# Altium project sch_v1.PrjPcb
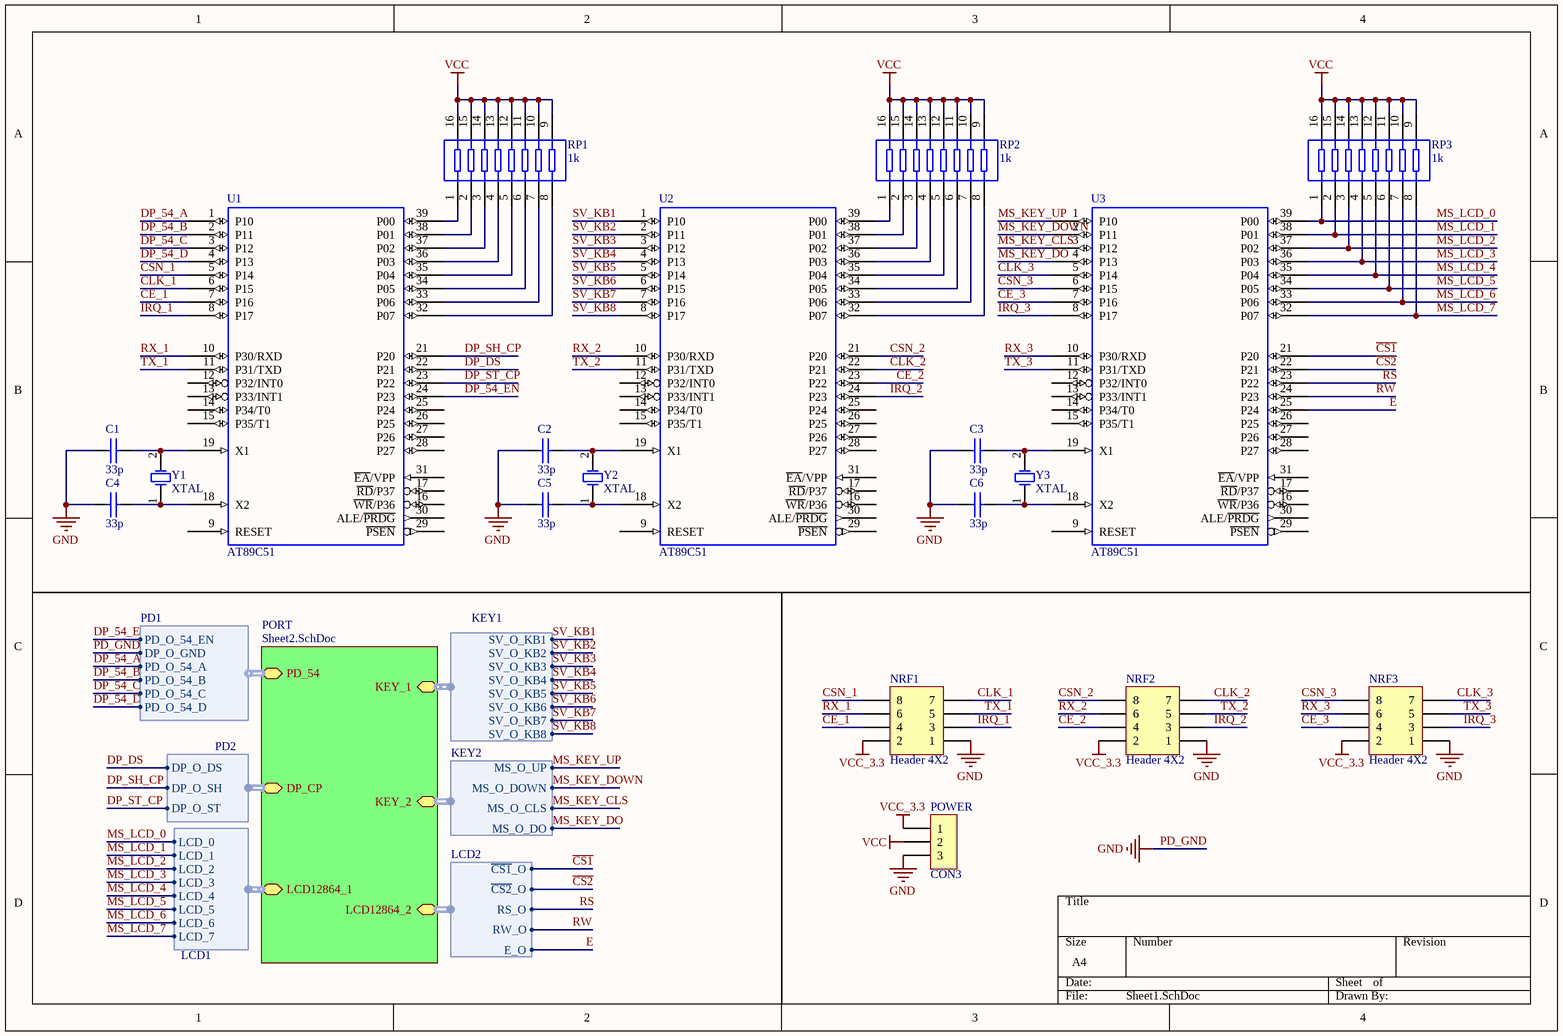
[diagram p0: Sheet1.SchDoc]
2 sheets, 66 parts. Net scope: hierarchical (ports join the sheet entries above them; power ports are global).
Sheets:
  Sheet1.SchDoc
    PORT = Sheet2.SchDoc

## Sheet Sheet1.SchDoc
size A4

### Parts
C1  33p  [RAD0.1]
C2  33p  [RAD0.1]
C3  33p  [RAD0.1]
C4  33p  [RAD0.1]
C5  33p  [RAD0.1]
C6  33p  [RAD0.1]
NRF1  Header 4X2  [HDR2X4]
NRF2  Header 4X2  [HDR2X4]
NRF3  Header 4X2  [HDR2X4]
POWER  CON3
RP1  1k  [DIP16]
RP2  1k  [DIP16]
RP3  1k  [DIP16]
U1  AT89C51  [DIP-40]
U2  AT89C51  [DIP-40]
U3  AT89C51  [DIP-40]
Y1  XTAL  [XTAL]
Y2  XTAL  [XTAL]
Y3  XTAL  [XTAL]

### Sub-sheets
PORT = Sheet2.SchDoc: PD_54 (harness PD1), KEY_1 (harness KEY1), KEY_2 (harness KEY2), DP_CP (harness PD2), LCD12864_1 (harness LCD1), LCD12864_2 (harness LCD2)

### Harnesses
PD1: DP_O_GND, PD_O_54_EN, PD_O_54_A, PD_O_54_B, PD_O_54_C, PD_O_54_D
KEY1: SV_O_KB1, SV_O_KB2, SV_O_KB3, SV_O_KB4, SV_O_KB5, SV_O_KB6, SV_O_KB7, SV_O_KB8
KEY2: MS_O_UP, MS_O_DOWN, MS_O_CLS, MS_O_DO
PD2: DP_O_SH, DP_O_ST, DP_O_DS
LCD1: LCD_0, LCD_1, LCD_2, LCD_3, LCD_4, LCD_5, LCD_6, LCD_7
LCD2: ~{CS1}_O, ~{CS2}_O, RS_O, RW_O, E_O

### Nets
GND: C1.1 C2.1 C3.1 C4.1 C5.1 C6.1 NRF1.1 NRF2.1 NRF3.1 POWER.3 U1.20(GND) U2.20(GND) U3.20(GND) ; sheet PORT/PD_54.DP_O_GND  [also labelled PD_GND]  [project net DP_GND]
VCC: POWER.2 RP1.9 RP1.10 RP1.11 RP1.12 RP1.13 RP1.14 RP1.15 RP1.16 RP2.9 RP2.10 RP2.11 RP2.12 RP2.13 RP2.14 RP2.15 RP2.16 RP3.9 RP3.10 RP3.11 RP3.12 RP3.13 RP3.14 RP3.15 RP3.16 U1.40(VCC) U2.40(VCC) U3.40(VCC)
VCC_3.3: NRF1.2 NRF2.2 NRF3.2 POWER.1
~{CS1}: U3.21(P20) ; sheet PORT/LCD12864_2.~{CS1}_O
~{CS2}: U3.22(P21) ; sheet PORT/LCD12864_2.~{CS2}_O
CE_1: NRF1.4 U1.7(P16)
CE_2: NRF2.4 U2.23(P22)
CE_3: NRF3.4 U3.7(P16)
CLK_1: NRF1.7 U1.6(P15)
CLK_2: NRF2.7 U2.22(P21)
CLK_3: NRF3.7 U3.5(P14)
CSN_1: NRF1.8 U1.5(P14)
CSN_2: NRF2.8 U2.21(P20)
CSN_3: NRF3.8 U3.6(P15)
DP_54_A: U1.1(P10) ; sheet PORT/PD_54.PD_O_54_A
DP_54_B: U1.2(P11) ; sheet PORT/PD_54.PD_O_54_B
DP_54_C: U1.3(P12) ; sheet PORT/PD_54.PD_O_54_C
DP_54_D: U1.4(P13) ; sheet PORT/PD_54.PD_O_54_D
DP_54_EN: U1.24(P23) ; sheet PORT/PD_54.PD_O_54_EN
DP_DS: U1.22(P21) ; sheet PORT/DP_CP.DP_O_DS
DP_SH_CP: U1.21(P20) ; sheet PORT/DP_CP.DP_O_SH
DP_ST_CP: U1.23(P22) ; sheet PORT/DP_CP.DP_O_ST
E: U3.25(P24) ; sheet PORT/LCD12864_2.E_O
IRQ_1: NRF1.3 U1.8(P17)
IRQ_2: NRF2.3 U2.24(P23)
IRQ_3: NRF3.3 U3.8(P17)
MS_KEY_CLS: U3.3(P12) ; sheet PORT/KEY_2.MS_O_CLS
MS_KEY_DO: U3.4(P13) ; sheet PORT/KEY_2.MS_O_DO
MS_KEY_DOWN: U3.2(P11) ; sheet PORT/KEY_2.MS_O_DOWN
MS_KEY_UP: U3.1(P10) ; sheet PORT/KEY_2.MS_O_UP
MS_LCD_0: RP3.1 U3.39(P00) ; sheet PORT/LCD12864_1.LCD_0
MS_LCD_1: RP3.2 U3.38(P01) ; sheet PORT/LCD12864_1.LCD_1
MS_LCD_2: RP3.3 U3.37(P02) ; sheet PORT/LCD12864_1.LCD_2
MS_LCD_3: RP3.4 U3.36(P03) ; sheet PORT/LCD12864_1.LCD_3
MS_LCD_4: RP3.5 U3.35(P04) ; sheet PORT/LCD12864_1.LCD_4
MS_LCD_5: RP3.6 U3.34(P05) ; sheet PORT/LCD12864_1.LCD_5
MS_LCD_6: RP3.7 U3.33(P06) ; sheet PORT/LCD12864_1.LCD_6
MS_LCD_7: RP3.8 U3.32(P07) ; sheet PORT/LCD12864_1.LCD_7
RS: U3.23(P22) ; sheet PORT/LCD12864_2.RS_O
RW: U3.24(P23) ; sheet PORT/LCD12864_2.RW_O
RX_1: NRF1.6 U1.10(P30/RXD)
RX_2: NRF2.6 U2.10(P30/RXD)
RX_3: NRF3.6 U3.10(P30/RXD)
SV_KB1: U2.1(P10) ; sheet PORT/KEY_1.SV_O_KB1
SV_KB2: U2.2(P11) ; sheet PORT/KEY_1.SV_O_KB2
SV_KB3: U2.3(P12) ; sheet PORT/KEY_1.SV_O_KB3
SV_KB4: U2.4(P13) ; sheet PORT/KEY_1.SV_O_KB4
SV_KB5: U2.5(P14) ; sheet PORT/KEY_1.SV_O_KB5
SV_KB6: U2.6(P15) ; sheet PORT/KEY_1.SV_O_KB6
SV_KB7: U2.7(P16) ; sheet PORT/KEY_1.SV_O_KB7
SV_KB8: U2.8(P17) ; sheet PORT/KEY_1.SV_O_KB8
TX_1: NRF1.5 U1.11(P31/TXD)
TX_2: NRF2.5 U2.11(P31/TXD)
TX_3: NRF3.5 U3.11(P31/TXD)
NetC1_2: C1.2 U1.19(X1) Y1.2
NetC2_2: C2.2 U2.19(X1) Y2.2
NetC3_2: C3.2 U3.19(X1) Y3.2
NetC4_2: C4.2 U1.18(X2) Y1.1
NetC5_2: C5.2 U2.18(X2) Y2.1
NetC6_2: C6.2 U3.18(X2) Y3.1
NetRP1_1: RP1.1 U1.39(P00)
NetRP1_2: RP1.2 U1.38(P01)
NetRP1_3: RP1.3 U1.37(P02)
NetRP1_4: RP1.4 U1.36(P03)
NetRP1_5: RP1.5 U1.35(P04)
NetRP1_6: RP1.6 U1.34(P05)
NetRP1_7: RP1.7 U1.33(P06)
NetRP1_8: RP1.8 U1.32(P07)
NetRP2_1: RP2.1 U2.39(P00)
NetRP2_2: RP2.2 U2.38(P01)
NetRP2_3: RP2.3 U2.37(P02)
NetRP2_4: RP2.4 U2.36(P03)
NetRP2_5: RP2.5 U2.35(P04)
NetRP2_6: RP2.6 U2.34(P05)
NetRP2_7: RP2.7 U2.33(P06)
NetRP2_8: RP2.8 U2.32(P07)

Not connected (* = marked no-connect by the designer): U1 9(RESET) 12(P32/INT0) 13(P33/INT1) 14(P34/T0) 15(P35/T1) 16(~{WR}/P36) 17(~{RD}/P37) 25(P24) 26(P25) 27(P26) 28(P27) 29(~{PSEN}) 30(ALE/~{PRDG}) 31(~{EA}/VPP); U2 9(RESET) 12(P32/INT0) 13(P33/INT1) 14(P34/T0) 15(P35/T1) 16(~{WR}/P36) 17(~{RD}/P37) 25(P24) 26(P25) 27(P26) 28(P27) 29(~{PSEN}) 30(ALE/~{PRDG}) 31(~{EA}/VPP); U3 9(RESET) 12(P32/INT0) 13(P33/INT1) 14(P34/T0) 15(P35/T1) 16(~{WR}/P36) 17(~{RD}/P37) 26(P25) 27(P26) 28(P27) 29(~{PSEN}) 30(ALE/~{PRDG}) 31(~{EA}/VPP)

### Library data of the parts
C1-C6 = 普通电容: Capacitor
NRF1-NRF3 = Header 4X2: Header, 4-Pin, Dual row; LatestRevisionDate: 17-Jul-2002; LatestRevisionNote: Re-released for DXP Platform.; Publisher: Altium Limited
POWER = CON3: Connector
RP1-RP3 = RESPACK4
Y1-Y3 = XTAL: XTAL: 12MHZ

## Sheet Sheet2.SchDoc
size A3
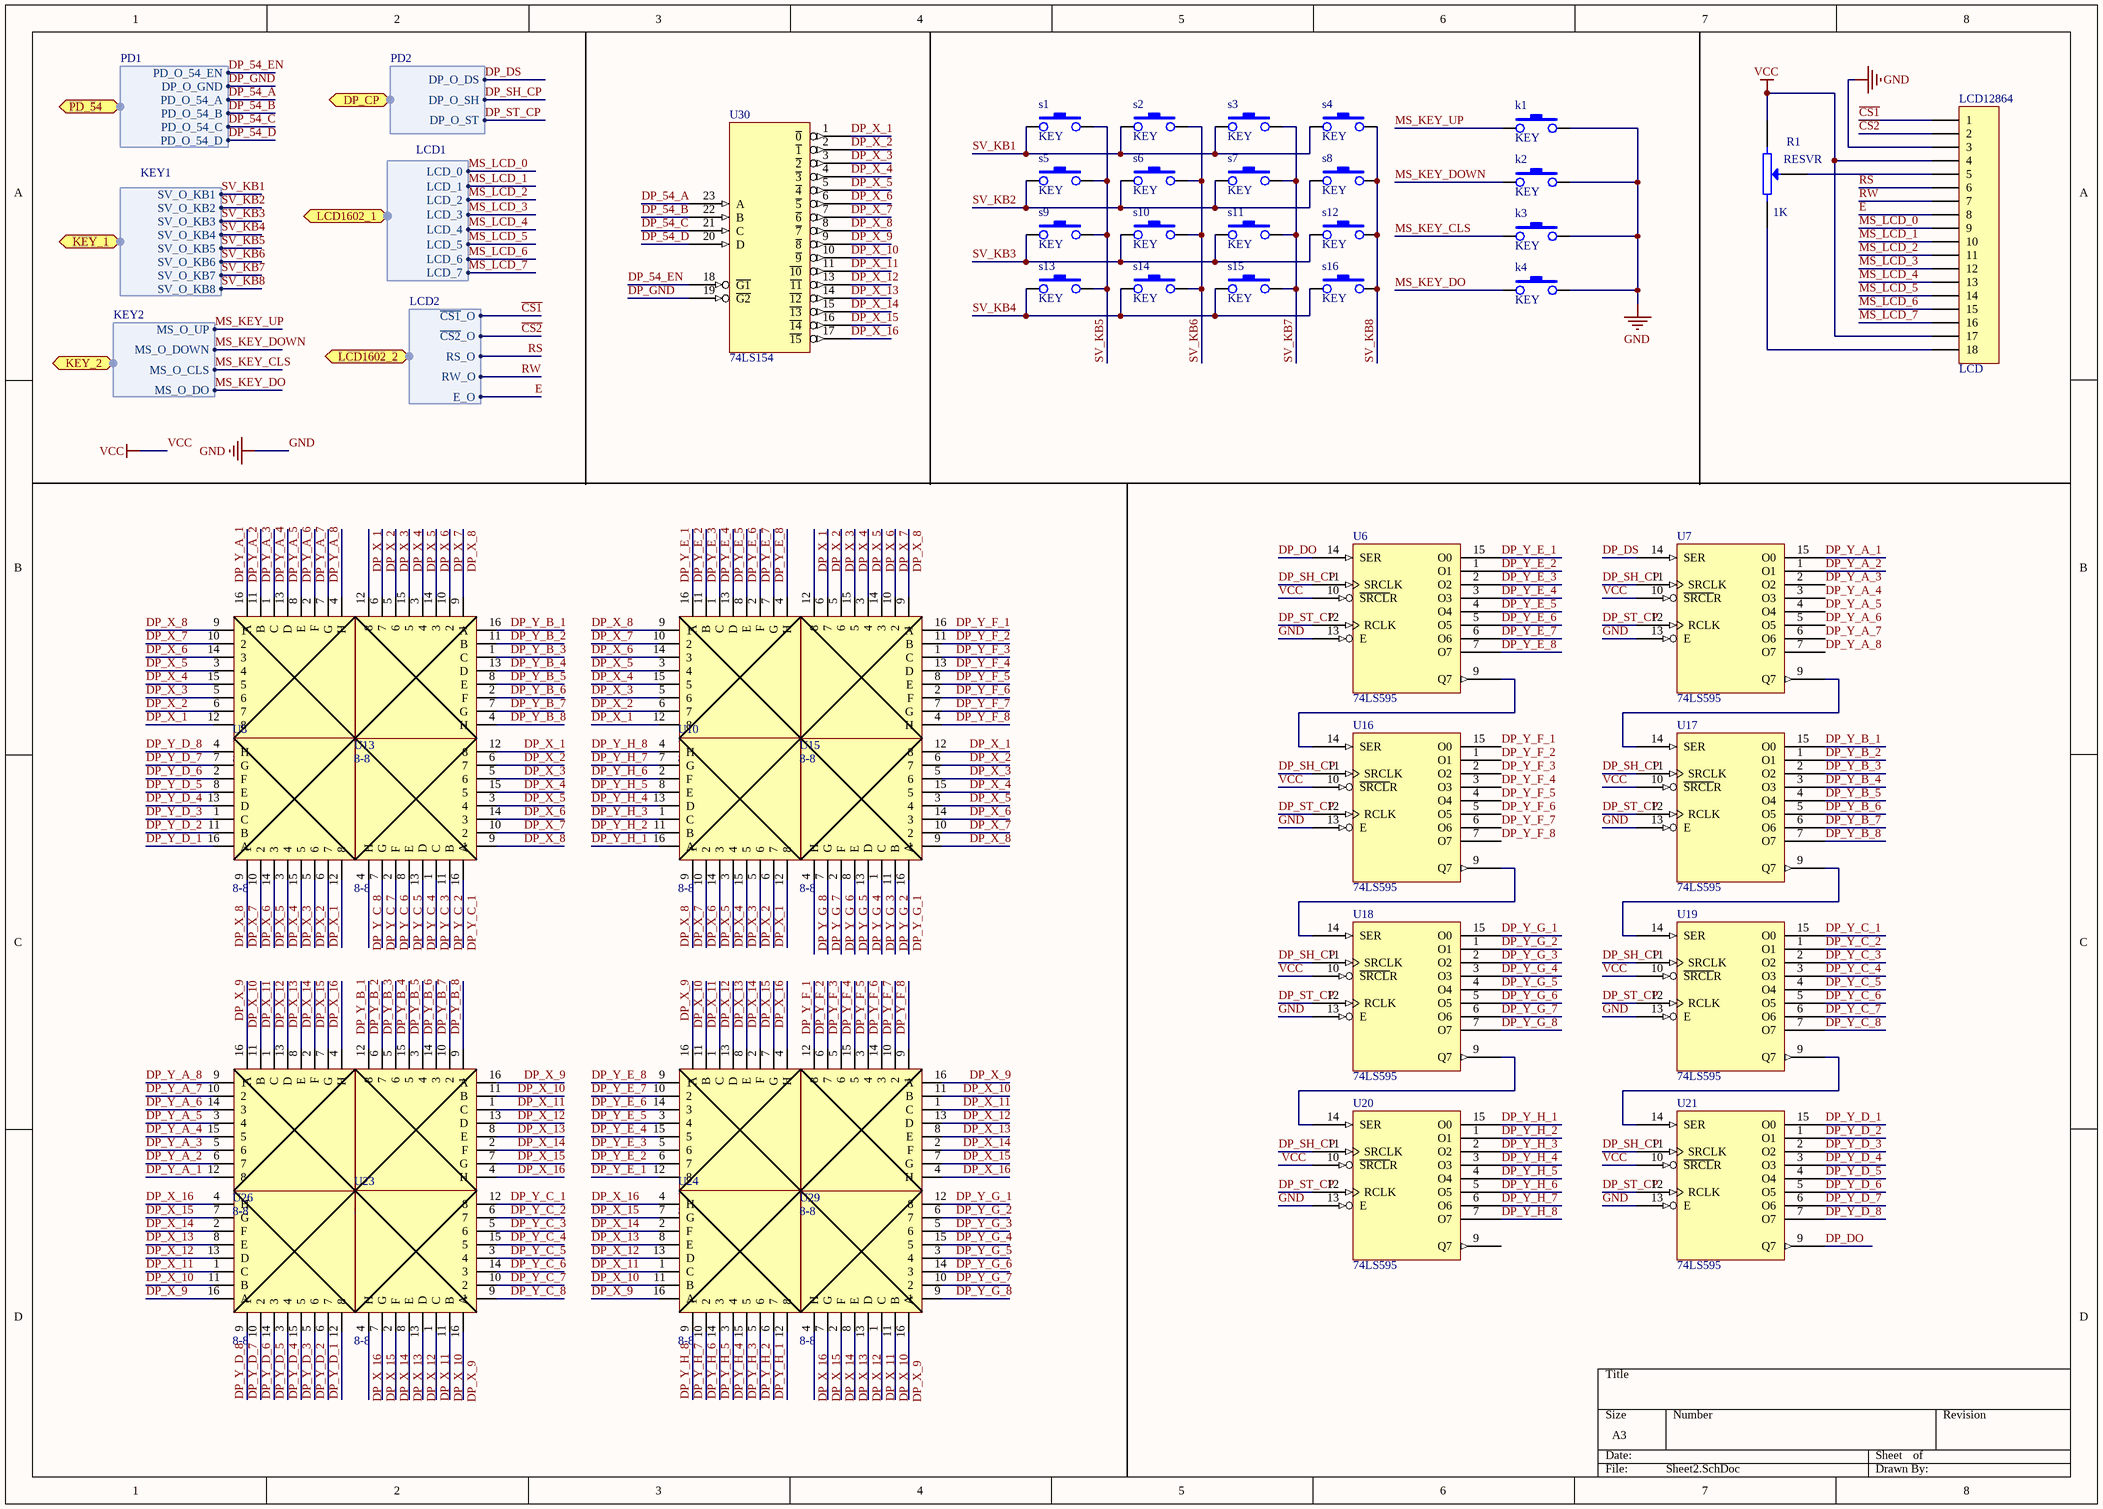
[diagram p1: Sheet2.SchDoc]

### Parts
k1  KEY
k2  KEY
k3  KEY
k4  KEY
LCD12864  LCD
R1  RESVR  value 1K  [VR]
s1  KEY
s2  KEY
s3  KEY
s4  KEY
s5  KEY
s6  KEY
s7  KEY
s8  KEY
s9  KEY
s10  KEY
s11  KEY
s12  KEY
s13  KEY
s14  KEY
s15  KEY
s16  KEY
U6  74LS595  [DIP-16]
U7  74LS595  [DIP-16]
U8  8-8
U9  8-8
U10  8-8
U11  8-8
U12  8-8
U13  8-8
U14  8-8
U15  8-8
U16  74LS595  [DIP-16]
U17  74LS595  [DIP-16]
U18  74LS595  [DIP-16]
U19  74LS595  [DIP-16]
U20  74LS595  [DIP-16]
U21  74LS595  [DIP-16]
U22  8-8
U23  8-8
U24  8-8
U25  8-8
U26  8-8
U27  8-8
U28  8-8
U29  8-8
U30  74LS154  [DIP-24]

### Ports
DP_CP (harness PD2), KEY_1 (harness KEY1), KEY_2 (harness KEY2), LCD1602_1 (harness LCD1), LCD1602_2 (harness LCD2), PD_54 (harness PD1)

### Harnesses
PD1: PD_O_54_EN, DP_O_GND, PD_O_54_A, PD_O_54_B, PD_O_54_C, PD_O_54_D
KEY1: SV_O_KB1, SV_O_KB2, SV_O_KB3, SV_O_KB4, SV_O_KB5, SV_O_KB6, SV_O_KB7, SV_O_KB8
KEY2: MS_O_UP, MS_O_DOWN, MS_O_CLS, MS_O_DO
PD2: DP_O_DS, DP_O_SH, DP_O_ST
LCD1: LCD_0, LCD_1, LCD_2, LCD_3, LCD_4, LCD_5, LCD_6, LCD_7
LCD2: ~{CS1}_O, ~{CS2}_O, RS_O, RW_O, E_O

### Nets
DP_GND: k1.2 k2.2 k3.2 k4.2 LCD12864.3 U6.8(GND) U6.13(E) U7.8(GND) U7.13(E) U16.8(GND) U16.13(E) U17.8(GND) U17.13(E) U18.8(GND) U18.13(E) U19.8(GND) U19.13(E) U20.8(GND) U20.13(E) U21.8(GND) U21.13(E) U30.12(GND) U30.19(~{G2}) ; port PD_54.DP_O_GND  [also labelled GND]
VCC: LCD12864.4 LCD12864.17 R1.1 U6.10(~{SRCL}R) U6.16(VCC) U7.10(~{SRCL}R) U7.16(VCC) U16.10(~{SRCL}R) U16.16(VCC) U17.10(~{SRCL}R) U17.16(VCC) U18.10(~{SRCL}R) U18.16(VCC) U19.10(~{SRCL}R) U19.16(VCC) U20.10(~{SRCL}R) U20.16(VCC) U21.10(~{SRCL}R) U21.16(VCC) U30.24(VCC)
~{CS1}: LCD12864.1 ; port LCD1602_2.~{CS1}_O
~{CS2}: LCD12864.2 ; port LCD1602_2.~{CS2}_O
DP_54_A: U30.23(A) ; port PD_54.PD_O_54_A
DP_54_B: U30.22(B) ; port PD_54.PD_O_54_B
DP_54_C: U30.21(C) ; port PD_54.PD_O_54_C
DP_54_D: U30.20(D) ; port PD_54.PD_O_54_D
DP_54_EN: U30.18(~{G1}) ; port PD_54.PD_O_54_EN
DP_DO: U6.14(SER) U21.9(Q7)
DP_DS: U7.14(SER) ; port DP_CP.DP_O_DS
DP_SH_CP: U6.11(SRCLK) U7.11(SRCLK) U16.11(SRCLK) U17.11(SRCLK) U18.11(SRCLK) U19.11(SRCLK) U20.11(SRCLK) U21.11(SRCLK) ; port DP_CP.DP_O_SH
DP_ST_CP: U6.12(RCLK) U7.12(RCLK) U16.12(RCLK) U17.12(RCLK) U18.12(RCLK) U19.12(RCLK) U20.12(RCLK) U21.12(RCLK) ; port DP_CP.DP_O_ST
DP_X_1: U8.12(8) U9.12(8) U10.12(8) U11.12(8) U12.12(8) U13.12(8) U14.12(8) U15.12(8) U30.1(~{0})
DP_X_2: U8.6(7) U9.6(7) U10.6(7) U11.6(7) U12.6(7) U13.6(7) U14.6(7) U15.6(7) U30.2(~{1})
DP_X_3: U8.5(6) U9.5(6) U10.5(6) U11.5(6) U12.5(6) U13.5(6) U14.5(6) U15.5(6) U30.3(~{2})
DP_X_4: U8.15(5) U9.15(5) U10.15(5) U11.15(5) U12.15(5) U13.15(5) U14.15(5) U15.15(5) U30.4(~{3})
DP_X_5: U8.3(4) U9.3(4) U10.3(4) U11.3(4) U12.3(4) U13.3(4) U14.3(4) U15.3(4) U30.5(~{4})
DP_X_6: U8.14(3) U9.14(3) U10.14(3) U11.14(3) U12.14(3) U13.14(3) U14.14(3) U15.14(3) U30.6(~{5})
DP_X_7: U8.10(2) U9.10(2) U10.10(2) U11.10(2) U12.10(2) U13.10(2) U14.10(2) U15.10(2) U30.7(~{6})
DP_X_8: U8.9(1) U9.9(1) U10.9(1) U11.9(1) U12.9(1) U13.9(1) U14.9(1) U15.9(1) U30.8(~{7})
DP_X_9: U22.16(A) U23.16(A) U24.16(A) U25.16(A) U26.16(A) U27.16(A) U28.16(A) U29.16(A) U30.9(~{8})
DP_X_10: U22.11(B) U23.11(B) U24.11(B) U25.11(B) U26.11(B) U27.11(B) U28.11(B) U29.11(B) U30.10(~{9})
DP_X_11: U22.1(C) U23.1(C) U24.1(C) U25.1(C) U26.1(C) U27.1(C) U28.1(C) U29.1(C) U30.11(~{10})
DP_X_12: U22.13(D) U23.13(D) U24.13(D) U25.13(D) U26.13(D) U27.13(D) U28.13(D) U29.13(D) U30.13(~{11})
DP_X_13: U22.8(E) U23.8(E) U24.8(E) U25.8(E) U26.8(E) U27.8(E) U28.8(E) U29.8(E) U30.14(~{12})
DP_X_14: U22.2(F) U23.2(F) U24.2(F) U25.2(F) U26.2(F) U27.2(F) U28.2(F) U29.2(F) U30.15(~{13})
DP_X_15: U22.7(G) U23.7(G) U24.7(G) U25.7(G) U26.7(G) U27.7(G) U28.7(G) U29.7(G) U30.16(~{14})
DP_X_16: U22.4(H) U23.4(H) U24.4(H) U25.4(H) U26.4(H) U27.4(H) U28.4(H) U29.4(H) U30.17(~{15})
DP_Y_A_1: U7.15(O0) U12.16(A) U26.12(8)
DP_Y_A_2: U7.1(O1) U12.11(B) U26.6(7)
DP_Y_A_3: U7.2(O2) U12.1(C) U26.5(6)
DP_Y_A_4: U7.3(O3) U12.13(D) U26.15(5)
DP_Y_A_5: U7.4(O4) U12.8(E) U26.3(4)
DP_Y_A_6: U7.5(O5) U12.2(F) U26.14(3)
DP_Y_A_7: U7.6(O6) U12.7(G) U26.10(2)
DP_Y_A_8: U7.7(O7) U12.4(H) U26.9(1)
DP_Y_B_1: U13.16(A) U17.15(O0) U27.12(8)
DP_Y_B_2: U13.11(B) U17.1(O1) U27.6(7)
DP_Y_B_3: U13.1(C) U17.2(O2) U27.5(6)
DP_Y_B_4: U13.13(D) U17.3(O3) U27.15(5)
DP_Y_B_5: U13.8(E) U17.4(O4) U27.3(4)
DP_Y_B_6: U13.2(F) U17.5(O5) U27.14(3)
DP_Y_B_7: U13.7(G) U17.6(O6) U27.10(2)
DP_Y_B_8: U13.4(H) U17.7(O7) U27.9(1)
DP_Y_C_1: U9.16(A) U19.15(O0) U23.12(8)
DP_Y_C_2: U9.11(B) U19.1(O1) U23.6(7)
DP_Y_C_3: U9.1(C) U19.2(O2) U23.5(6)
DP_Y_C_4: U9.13(D) U19.3(O3) U23.15(5)
DP_Y_C_5: U9.8(E) U19.4(O4) U23.3(4)
DP_Y_C_6: U9.2(F) U19.5(O5) U23.14(3)
DP_Y_C_7: U9.7(G) U19.6(O6) U23.10(2)
DP_Y_C_8: U9.4(H) U19.7(O7) U23.9(1)
DP_Y_D_1: U8.16(A) U21.15(O0) U22.12(8)
DP_Y_D_2: U8.11(B) U21.1(O1) U22.6(7)
DP_Y_D_3: U8.1(C) U21.2(O2) U22.5(6)
DP_Y_D_4: U8.13(D) U21.3(O3) U22.15(5)
DP_Y_D_5: U8.8(E) U21.4(O4) U22.3(4)
DP_Y_D_6: U8.2(F) U21.5(O5) U22.14(3)
DP_Y_D_7: U8.7(G) U21.6(O6) U22.10(2)
DP_Y_D_8: U8.4(H) U21.7(O7) U22.9(1)
DP_Y_E_1: U6.15(O0) U14.16(A) U28.12(8)
DP_Y_E_2: U6.1(O1) U14.11(B) U28.6(7)
DP_Y_E_3: U6.2(O2) U14.1(C) U28.5(6)
DP_Y_E_4: U6.3(O3) U14.13(D) U28.15(5)
DP_Y_E_5: U6.4(O4) U14.8(E) U28.3(4)
DP_Y_E_6: U6.5(O5) U14.2(F) U28.14(3)
DP_Y_E_7: U6.6(O6) U14.7(G) U28.10(2)
DP_Y_E_8: U6.7(O7) U14.4(H) U28.9(1)
DP_Y_F_1: U15.16(A) U16.15(O0) U29.12(8)
DP_Y_F_2: U15.11(B) U16.1(O1) U29.6(7)
DP_Y_F_3: U15.1(C) U16.2(O2) U29.5(6)
DP_Y_F_4: U15.13(D) U16.3(O3) U29.15(5)
DP_Y_F_5: U15.8(E) U16.4(O4) U29.3(4)
DP_Y_F_6: U15.2(F) U16.5(O5) U29.14(3)
DP_Y_F_7: U15.7(G) U16.6(O6) U29.10(2)
DP_Y_F_8: U15.4(H) U16.7(O7) U29.9(1)
DP_Y_G_1: U11.16(A) U18.15(O0) U25.12(8)
DP_Y_G_2: U11.11(B) U18.1(O1) U25.6(7)
DP_Y_G_3: U11.1(C) U18.2(O2) U25.5(6)
DP_Y_G_4: U11.13(D) U18.3(O3) U25.15(5)
DP_Y_G_5: U11.8(E) U18.4(O4) U25.3(4)
DP_Y_G_6: U11.2(F) U18.5(O5) U25.14(3)
DP_Y_G_7: U11.7(G) U18.6(O6) U25.10(2)
DP_Y_G_8: U11.4(H) U18.7(O7) U25.9(1)
DP_Y_H_1: U10.16(A) U20.15(O0) U24.12(8)
DP_Y_H_2: U10.11(B) U20.1(O1) U24.6(7)
DP_Y_H_3: U10.1(C) U20.2(O2) U24.5(6)
DP_Y_H_4: U10.13(D) U20.3(O3) U24.15(5)
DP_Y_H_5: U10.8(E) U20.4(O4) U24.3(4)
DP_Y_H_6: U10.2(F) U20.5(O5) U24.14(3)
DP_Y_H_7: U10.7(G) U20.6(O6) U24.10(2)
DP_Y_H_8: U10.4(H) U20.7(O7) U24.9(1)
E: LCD12864.8 ; port LCD1602_2.E_O
MS_KEY_CLS: k3.1 ; port KEY_2.MS_O_CLS
MS_KEY_DO: k4.1 ; port KEY_2.MS_O_DO
MS_KEY_DOWN: k2.1 ; port KEY_2.MS_O_DOWN
MS_KEY_UP: k1.1 ; port KEY_2.MS_O_UP
MS_LCD_0: LCD12864.9 ; port LCD1602_1.LCD_0
MS_LCD_1: LCD12864.10 ; port LCD1602_1.LCD_1
MS_LCD_2: LCD12864.11 ; port LCD1602_1.LCD_2
MS_LCD_3: LCD12864.12 ; port LCD1602_1.LCD_3
MS_LCD_4: LCD12864.13 ; port LCD1602_1.LCD_4
MS_LCD_5: LCD12864.14 ; port LCD1602_1.LCD_5
MS_LCD_6: LCD12864.15 ; port LCD1602_1.LCD_6
MS_LCD_7: LCD12864.16 ; port LCD1602_1.LCD_7
RS: LCD12864.6 ; port LCD1602_2.RS_O
RW: LCD12864.7 ; port LCD1602_2.RW_O
SV_KB1: s1.1 s2.1 s3.1 s4.1 ; port KEY_1.SV_O_KB1
SV_KB2: s5.1 s6.1 s7.1 s8.1 ; port KEY_1.SV_O_KB2
SV_KB3: s9.1 s10.1 s11.1 s12.1 ; port KEY_1.SV_O_KB3
SV_KB4: s13.1 s14.1 s15.1 s16.1 ; port KEY_1.SV_O_KB4
SV_KB5: s1.2 s5.2 s9.2 s13.2 ; port KEY_1.SV_O_KB5
SV_KB6: s2.2 s6.2 s10.2 s14.2 ; port KEY_1.SV_O_KB6
SV_KB7: s3.2 s7.2 s11.2 s15.2 ; port KEY_1.SV_O_KB7
SV_KB8: s4.2 s8.2 s12.2 s16.2 ; port KEY_1.SV_O_KB8
NetLCD12864_5: LCD12864.5 R1.3(W)
NetLCD12864_18: LCD12864.18 R1.2
NetU6_9: U6.9(Q7) U16.14(SER)
NetU7_9: U7.9(Q7) U17.14(SER)
NetU16_9: U16.9(Q7) U18.14(SER)
NetU17_9: U17.9(Q7) U19.14(SER)
NetU18_9: U18.9(Q7) U20.14(SER)
NetU19_9: U19.9(Q7) U21.14(SER)

Not connected (* = marked no-connect by the designer): U20 9(Q7)

### Library data of the parts
LCD12864 = CON18: Connector
R1 = RESVR: Potentiometer
U8-U15 U22-U29 = 8-8点阵: 8-8: RAD

## Nets that join several sheets
DP_GND: Sheet1 (13 pins), Sheet2 (23 pins)
VCC: Sheet1 (28 pins), Sheet2 (20 pins)
DP_54_A: Sheet1 (U1.1), Sheet2 (U30.23)
DP_54_B: Sheet1 (U1.2), Sheet2 (U30.22)
DP_54_C: Sheet1 (U1.3), Sheet2 (U30.21)
DP_54_D: Sheet1 (U1.4), Sheet2 (U30.20)
DP_54_EN: Sheet1 (U1.24), Sheet2 (U30.18)
DP_DS: Sheet1 (U1.22), Sheet2 (U7.14)
DP_SH_CP: Sheet1 (U1.21), Sheet2 (8 pins)
DP_ST_CP: Sheet1 (U1.23), Sheet2 (8 pins)
MS_KEY_CLS: Sheet1 (U3.3), Sheet2 (k3.1)
MS_KEY_DO: Sheet1 (U3.4), Sheet2 (k4.1)
MS_KEY_DOWN: Sheet1 (U3.2), Sheet2 (k2.1)
MS_KEY_UP: Sheet1 (U3.1), Sheet2 (k1.1)
SV_KB1: Sheet1 (U2.1), Sheet2 (s1.1 s2.1 s3.1 s4.1)
SV_KB2: Sheet1 (U2.2), Sheet2 (s5.1 s6.1 s7.1 s8.1)
SV_KB3: Sheet1 (U2.3), Sheet2 (s9.1 s10.1 s11.1 s12.1)
SV_KB4: Sheet1 (U2.4), Sheet2 (s13.1 s14.1 s15.1 s16.1)
SV_KB5: Sheet1 (U2.5), Sheet2 (s1.2 s5.2 s9.2 s13.2)
SV_KB6: Sheet1 (U2.6), Sheet2 (s2.2 s6.2 s10.2 s14.2)
SV_KB7: Sheet1 (U2.7), Sheet2 (s3.2 s7.2 s11.2 s15.2)
SV_KB8: Sheet1 (U2.8), Sheet2 (s4.2 s8.2 s12.2 s16.2)